# EAGLE design Camera (EAGLE 9.4.0)
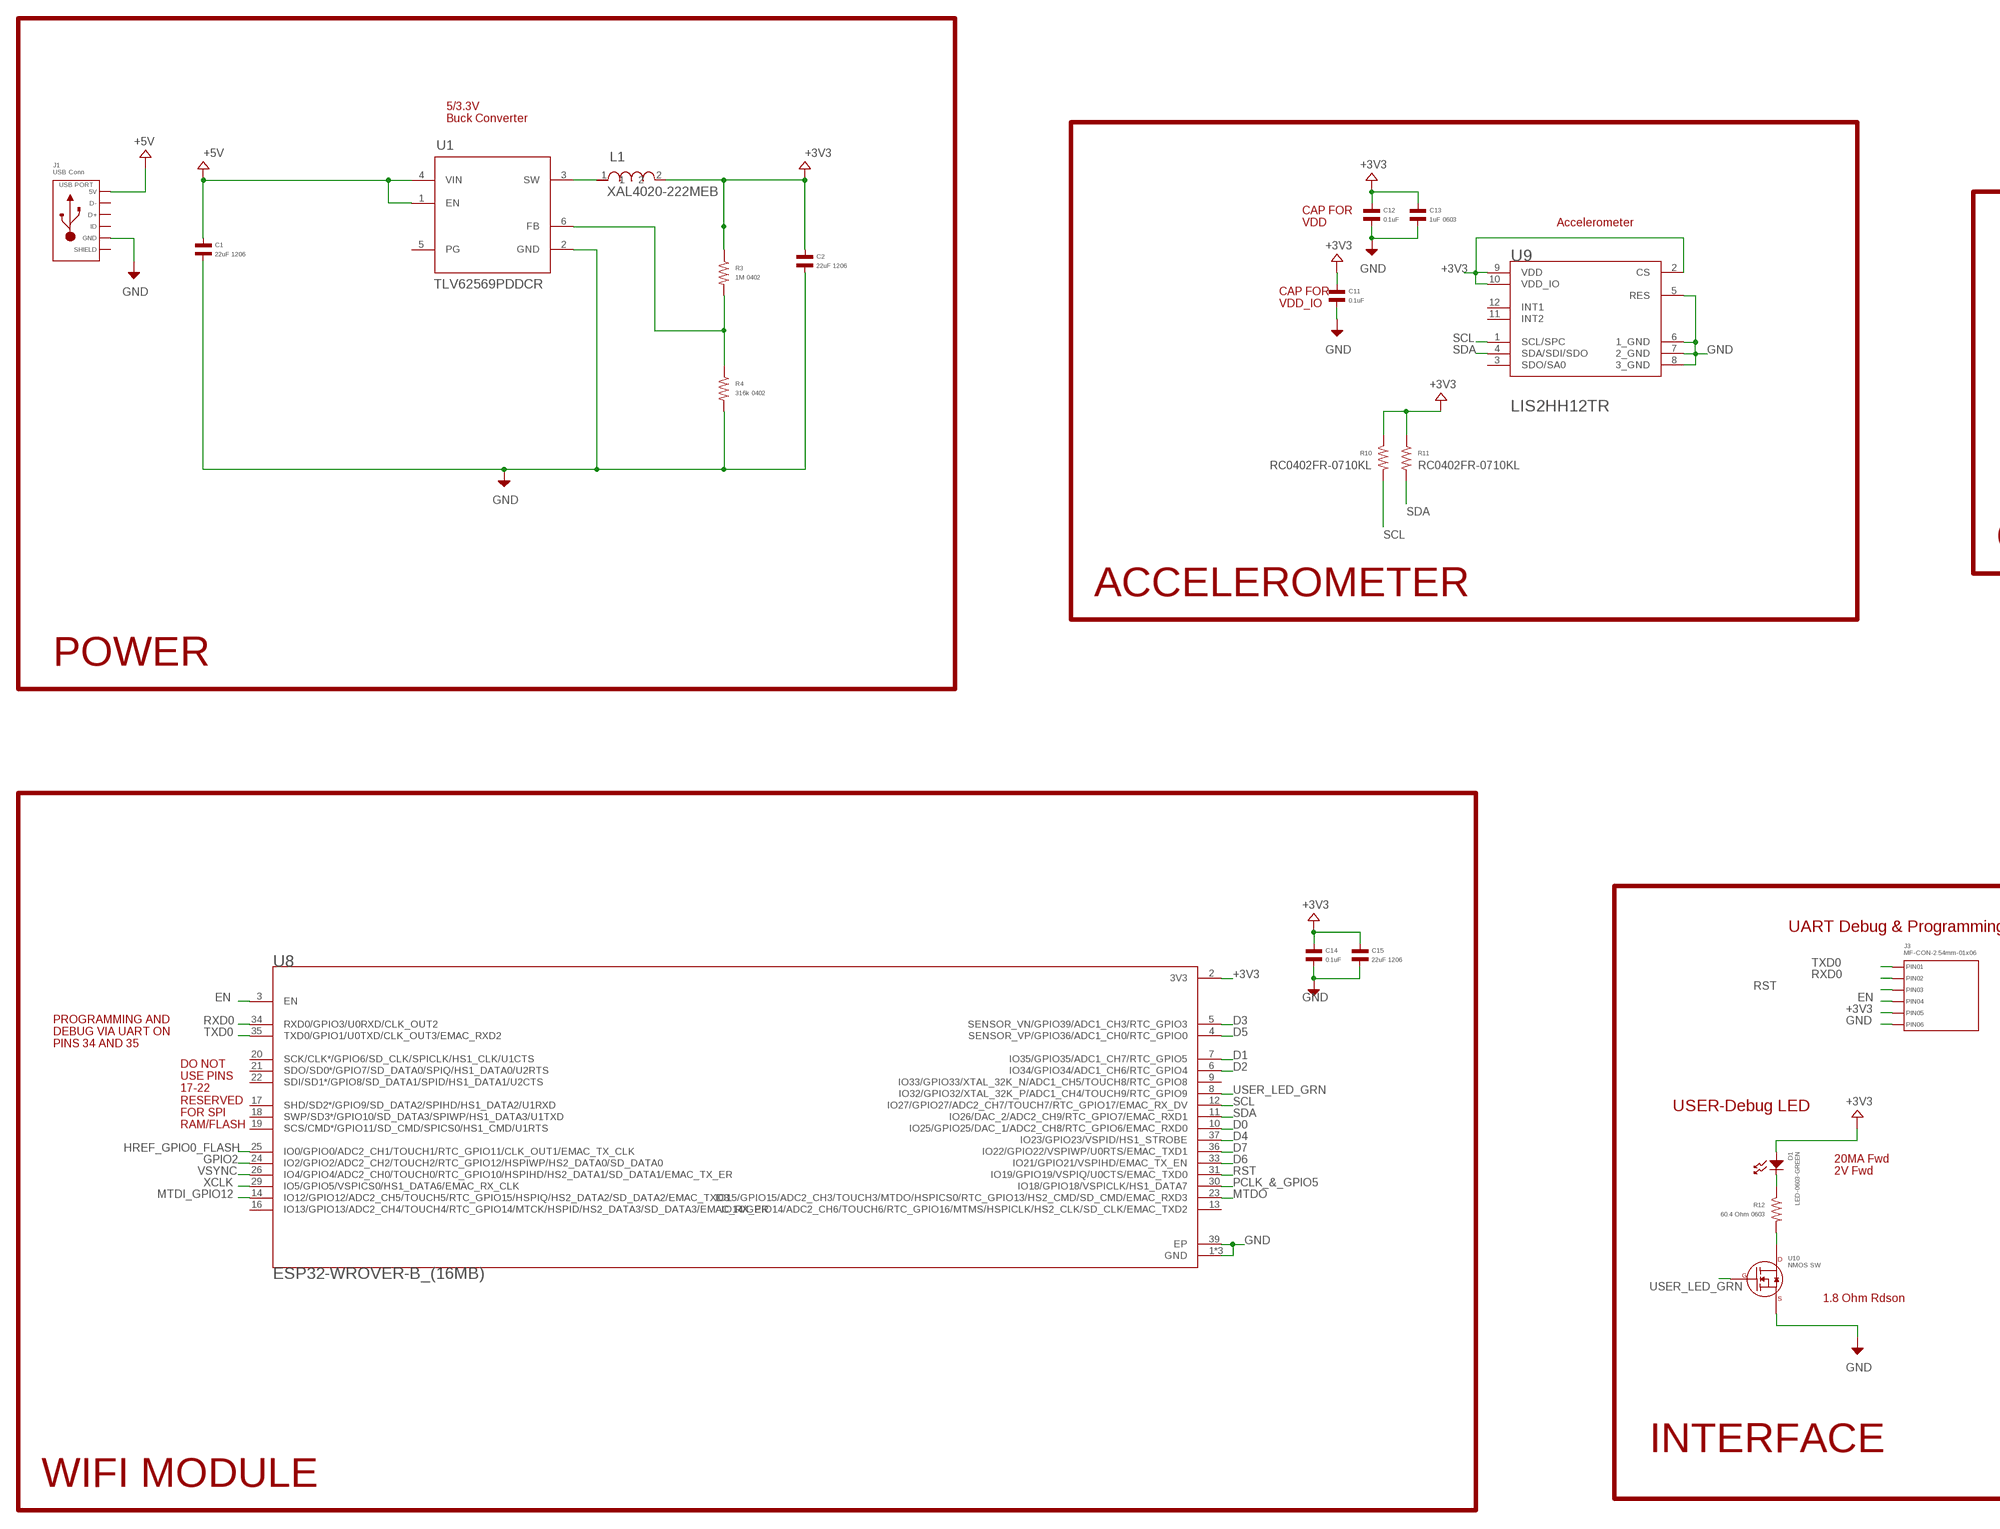
[diagram p0: schematic, sheet 1, part 1 of 2]
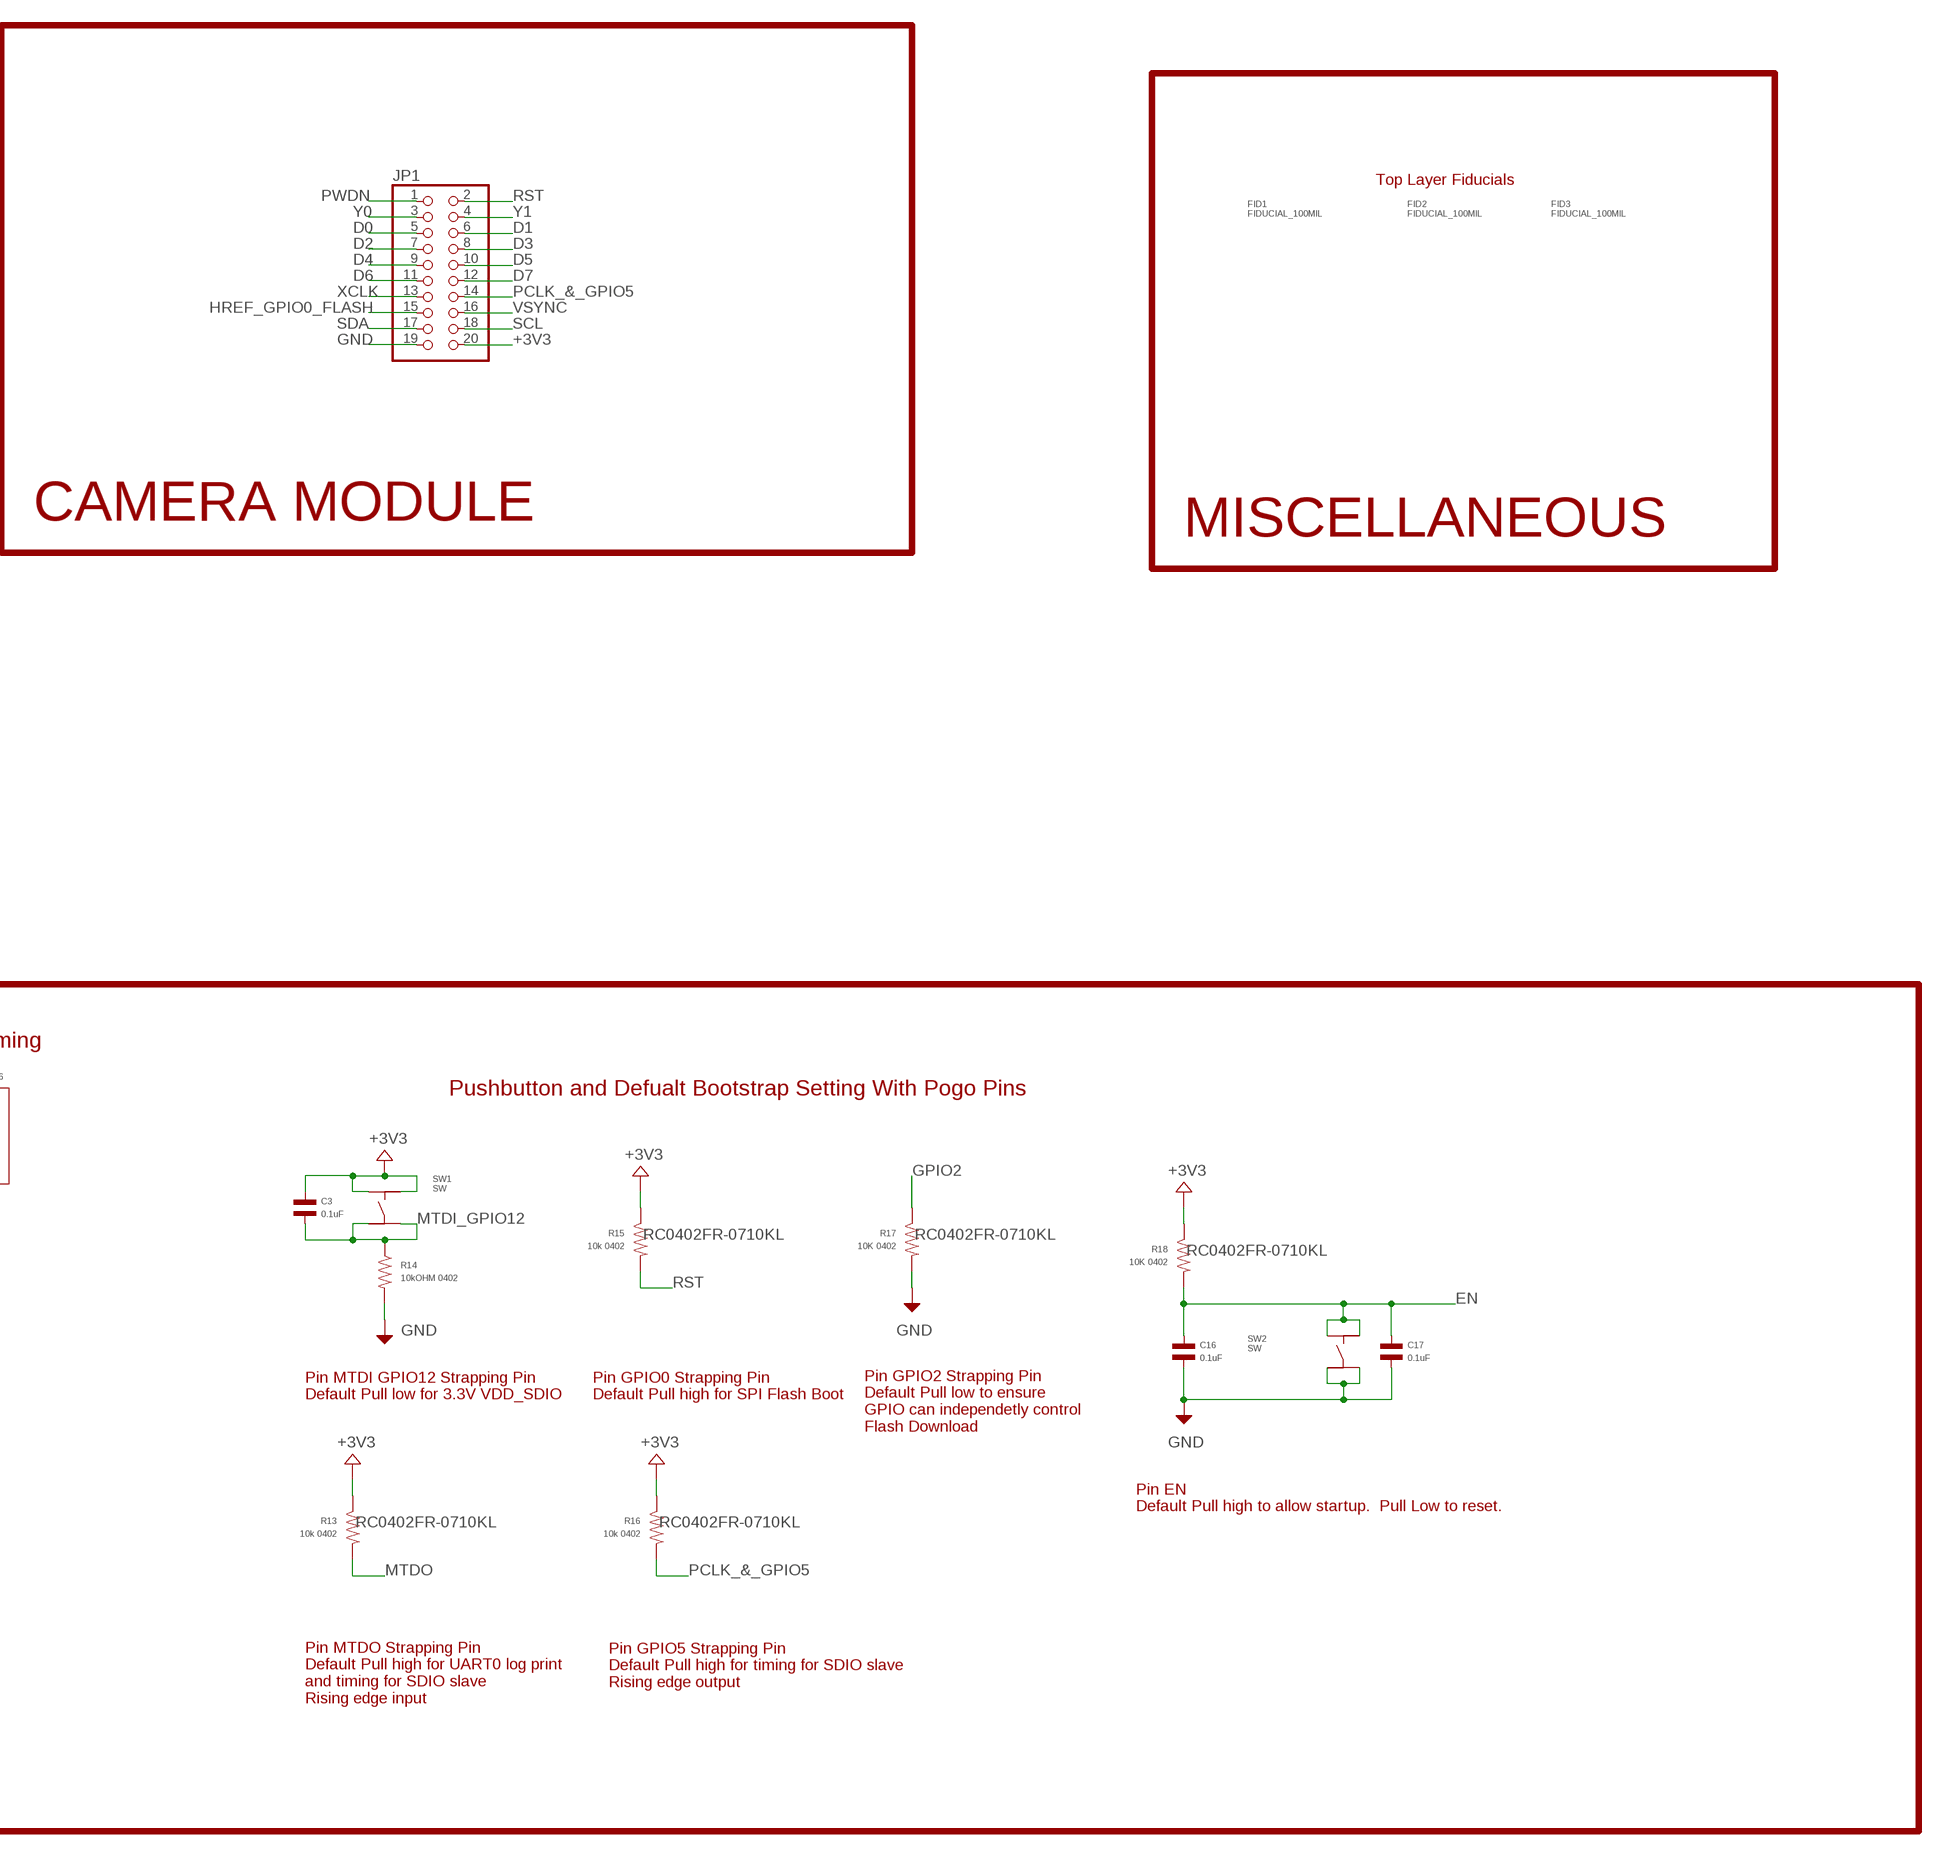
[diagram p1: schematic, sheet 1, part 2 of 2]

## Parts
C1  22uF 1206  CAPACITOR_NP_1206  [C1206]
C2  22uF 1206  CAPACITOR_NP_1206  [C1206]
C3  0.1uF  CAPACITOR_NP_0402  [C0402]
C11  0.1uF  CAPACITOR_NP_0402  [C0402]
C12  0.1uF  CAPACITOR_NP_0402  [C0402]
C13  1uF 0603  CAPACITOR_NP_0603  [C0603]
C14  0.1uF  CAPACITOR_NP_0402  [C0402]
C15  22uF 1206  CAPACITOR_NP_1206  [C1206]
C16  0.1uF  CAPACITOR_NP_0402  [C0402]
C17  0.1uF  CAPACITOR_NP_0402  [C0402]
D1  LED-0603-GREEN  LED_SINGLE-0603-GREEN  [LED0603]
FID1  FIDUCIAL_100MIL  [FIDUCIAL_100MIL]
FID2  FIDUCIAL_100MIL  [FIDUCIAL_100MIL]
FID3  FIDUCIAL_100MIL  [FIDUCIAL_100MIL]
J1  USB Conn  USB_MICRO_RIGHT  [MICROUSB-RIGHT]
J3  MF-CON-2.54mm-01x06  CON_01X06_PTH_2.54MM  [PTH_2.54MM_01X06]
JP1  PINHD-2X10  [2X10]
L1  XAL4020-222MEB  [XAL4020]
R3  1M 0402  RESISTOR_0402  [R0402]
R4  316k 0402  RESISTOR_0402  [R0402]
R10  RESISTOR_0402  [R0402]
R11  RESISTOR_0402  [R0402]
R12  60.4 Ohm 0603  RESISTOR_0603  [R0603]
R13  10k 0402  RESISTOR_0402  [R0402]
R14  10kOHM 0402  RESISTOR_0402  [R0402]
R15  10k 0402  RESISTOR_0402  [R0402]
R16  10k 0402  RESISTOR_0402  [R0402]
R17  10K 0402  RESISTOR_0402  [R0402]
R18  10K 0402  RESISTOR_0402  [R0402]
SW1  SW  TACT_6MM  [TACT6MM]
SW2  SW  TACT_6MM  [TACT6MM]
U1  TLV62569PDDCR  [DDC0006A]
U8  ESP32-WROVER-B_(16MB)  [XCVR_ESP32-WROVER-B_(16MB)]
U9  ST_MICROELECTRONICS_LIS2HH12TRST_MICROELECTRONICS_LIS2HH12TR_0_0  [ST_MICROELECTRONICS_LIS2HH12TR_0]
U10  NMOS SW  N-CHANNEL_FET_BSS138_SOT-23-3  [SOT-23-3]

## Nets
+3V3 [Power - 2A]: C2.P$1 C3.P$1 C11.P$1 C12.P$1 C13.P$1 C14.P$1 C15.P$1 D1.ANODE J3.P$5(PIN5) JP1.20 L1.2 R3.P$1 R10.P$1 R11.P$1 R13.P$1 R15.P$1 R16.P$1 R18.P$1 SW1.P$1 SW1.P$2 U8.2(3V3) U9.2(CS) U9.9(VDD) U9.10(VDD_IO)
+5V [Power - 2A]: C1.P$1 J1.1(5V) U1.1(EN) U1.4(VIN)
D0: JP1.5 U8.10(IO25/GPIO25/DAC_1/ADC2_CH8/RTC_GPIO6/EMAC_RXD0)
D1: JP1.6 U8.7(IO35/GPIO35/ADC1_CH7/RTC_GPIO5)
D2: JP1.7 U8.6(IO34/GPIO34/ADC1_CH6/RTC_GPIO4)
D3: JP1.8 U8.5(SENSOR_VN/GPIO39/ADC1_CH3/RTC_GPIO3)
D4: JP1.9 U8.37(IO23/GPIO23/VSPID/HS1_STROBE)
D5: JP1.10 U8.4(SENSOR_VP/GPIO36/ADC1_CH0/RTC_GPIO0)
D6: JP1.11 U8.33(IO21/GPIO21/VSPIHD/EMAC_TX_EN)
D7: JP1.12 U8.36(IO22/GPIO22/VSPIWP/U0RTS/EMAC_TXD1)
EN: C16.P$1 C17.P$1 J3.P$4(PIN4) R18.P$2 SW2.P$1 SW2.P$2 U8.3(EN)
GND [Power - 2A]: C1.P$2 C2.P$2 C11.P$2 C12.P$2 C13.P$2 C14.P$2 C15.P$2 C16.P$2 C17.P$2 J1.5(GND) J3.P$6(PIN6) JP1.19 R4.P$2 R14.P$2 R17.P$2 SW2.P$3 SW2.P$4 U1.2(GND) U8.1(GND) U8.15(GND) U8.38(GND) U8.39(EP) U9.5(RES) U9.6(1_GND) U9.7(2_GND) U9.8(3_GND) U10.P$2(SOURCE)
GPIO2: R17.P$1 U8.24(IO2/GPIO2/ADC2_CH2/TOUCH2/RTC_GPIO12/HSPIWP/HS2_DATA0/SD_DATA0)
HREF_GPIO0_FLASH: JP1.15 U8.25(IO0/GPIO0/ADC2_CH1/TOUCH1/RTC_GPIO11/CLK_OUT1/EMAC_TX_CLK)
MTDI_GPIO12: C3.P$2 R14.P$1 SW1.P$3 SW1.P$4 U8.14(IO12/GPIO12/ADC2_CH5/TOUCH5/RTC_GPIO15/HSPIQ/HS2_DATA2/SD_DATA2/EMAC_TXD3)
MTDO: R13.P$2 U8.23(IO15/GPIO15/ADC2_CH3/TOUCH3/MTDO/HSPICS0/RTC_GPIO13/HS2_CMD/SD_CMD/EMAC_RXD3)
N$12 [Power - 2A]: L1.1 U1.3(SW)
N$16: R3.P$2 R4.P$1 U1.6(FB)
N$20: D1.CATHODE R12.P$1
N$22: R12.P$2 U10.P$3(DRAIN)
PCLK_&_GPIO5: JP1.14 R16.P$2 U8.30(IO18/GPIO18/VSPICLK/HS1_DATA7)
PWDN: JP1.1
RST: J3.P$3(PIN3) JP1.2 R15.P$2 U8.31(IO19/GPIO19/VSPIQ/U0CTS/EMAC_TXD0)
RXD0: J3.P$2(PIN2) U8.34(RXD0/GPIO3/U0RXD/CLK_OUT2)
SCL: JP1.18 R10.P$2 U8.12(IO27/GPIO27/ADC2_CH7/TOUCH7/RTC_GPIO17/EMAC_RX_DV) U9.1(SCL/SPC)
SDA: JP1.17 R11.P$2 U8.11(IO26/DAC_2/ADC2_CH9/RTC_GPIO7/EMAC_RXD1) U9.4(SDA/SDI/SDO)
TXD0: J3.P$1(PIN1) U8.35(TXD0/GPIO1/U0TXD/CLK_OUT3/EMAC_RXD2)
USER_LED_GRN: U8.8(IO32/GPIO32/XTAL_32K_P/ADC1_CH4/TOUCH9/RTC_GPIO9) U10.P$1(GATE)
VSYNC: JP1.16 U8.26(IO4/GPIO4/ADC2_CH0/TOUCH0/RTC_GPIO10/HSPIHD/HS2_DATA1/SD_DATA1/EMAC_TX_ER)
XCLK: JP1.13 U8.29(IO5/GPIO5/VSPICS0/HS1_DATA6/EMAC_RX_CLK)
Y0: JP1.3
Y1: JP1.4
Unconnected: J1.2(D-) J1.3(D+) J1.4(ID) U1.5(PG) U8.9(IO33/GPIO33/XTAL_32K_N/ADC1_CH5/TOUCH8/RTC_GPIO8) U8.13(IO14/GPIO14/ADC2_CH6/TOUCH6/RTC_GPIO16/MTMS/HSPICLK/HS2_CLK/SD_CLK/EMAC_TXD2) U8.16(IO13/GPIO13/ADC2_CH4/TOUCH4/RTC_GPIO14/MTCK/HSPID/HS2_DATA3/SD_DATA3/EMAC_RX_ER) U8.17(SHD/SD2*/GPIO9/SD_DATA2/SPIHD/HS1_DATA2/U1RXD) U8.18(SWP/SD3*/GPIO10/SD_DATA3/SPIWP/HS1_DATA3/U1TXD) U8.19(SCS/CMD*/GPIO11/SD_CMD/SPICS0/HS1_CMD/U1RTS) U8.20(SCK/CLK*/GPIO6/SD_CLK/SPICLK/HS1_CLK/U1CTS) U8.21(SDO/SD0*/GPIO7/SD_DATA0/SPIQ/HS1_DATA0/U2RTS) U8.22(SDI/SD1*/GPIO8/SD_DATA1/SPID/HS1_DATA1/U2CTS) U9.3(SDO/SA0) U9.11(INT2) U9.12(INT1)

## Notes on the sheet
- 5/3.3V
  Buck Converter
- CAP FOR
  VDD
- Accelerometer
- CAP FOR
  VDD_IO
- Top Layer Fiducials
- CAMERA MODULE | MISCELLANEOUS
- ACCELEROMETER
- POWER
- UART Debug & Programming
- Pushbutton and Defualt Bootstrap Setting With Pogo Pins
- PROGRAMMING AND 
  DEBUG VIA UART ON 
  PINS 34 AND 35
- DO NOT 
  USE PINS 
  17-22
  RESERVED 
  FOR SPI 
  RAM/FLASH
- USER-Debug LED
- 20MA Fwd
  2V Fwd
- Pin MTDI GPIO12 Strapping Pin
  Default Pull low for 3.3V VDD_SDIO
- Pin GPIO0 Strapping Pin
  Default Pull high for SPI Flash Boot
- Pin GPIO2 Strapping Pin
  Default Pull low to ensure
  GPIO can independetly control
  Flash Download
- Pin EN
  Default Pull high to allow startup.  Pull Low to reset.
- 1.8 Ohm Rdson
- Pin GPIO5 Strapping Pin
  Default Pull high for timing for SDIO slave
  Rising edge output
- Pin MTDO Strapping Pin
  Default Pull high for UART0 log print
  and timing for SDIO slave 
  Rising edge input
- INTERFACE
- WIFI MODULE

## Power pins joined to a net without a drawn wire
SLD: J1.S1(SLD) J1.S2(SLD) J1.S3(SLD) J1.S4(SLD) J1.S5(SLD) J1.S6(SLD)

## Library data of the parts
C1 = MF_Passives:CAPACITOR_NP: Library: MF_Passives Description: Device for Non-Polarized Capacitors. Manufacture part number (MPN) can be added via Attributes. Check https://factory.macrofab.com/parts for the house parts list.; HOUSEPART: NO; MPN: CL31A226KPHNNNE; POPULATE: 1
C2 C15 = MF_Passives:CAPACITOR_NP: Library: MF_Passives Description: Device for Non-Polarized Capacitors. Manufacture part number (MPN) can be added via Attributes. Check https://factory.macrofab.com/parts for the house parts list.; HOUSEPART: YES; MPN: CL31A226KPHNNNE; POPULATE: 1
C3 C12 C14 C16 C17 = MF_Passives:CAPACITOR_NP: Library: MF_Passives Description: Device for Non-Polarized Capacitors. Manufacture part number (MPN) can be added via Attributes. Check https://factory.macrofab.com/parts for the house parts list.; HOUSEPART: NO; MPN: CL05B104KO5NNNC; POPULATE: 1
C11 = MF_Passives:CAPACITOR_NP: Library: MF_Passives Description: Device for Non-Polarized Capacitors. Manufacture part number (MPN) can be added via Attributes. Check https://factory.macrofab.com/parts for the house parts list.; HOUSEPART: No; MPN: CL05B104KO5NNNC; POPULATE: 1
C13 = MF_Passives:CAPACITOR_NP: Library: MF_Passives Description: Device for Non-Polarized Capacitors. Manufacture part number (MPN) can be added via Attributes. Check https://factory.macrofab.com/parts for the house parts list.; HOUSEPART: NO; MPN: CL05A105KO5NNNC; POPULATE: 1
D1 = MF_LEDs:LED_SINGLE: Library: MF_LEDs Description: Device for Single LED Packages. Manufacture part number (MFG#) can be added via Attributes.; HOUSEPART: NO; MPN: LTST-C190KGKT; POPULATE: 1; VALUE: MF-LED-0603-GREEN
FID1-FID3 = MF_Aesthetics:FIDUCIAL: Library: MF_Aesthetics Description: Fiducial marking for PCB alignment inside PNP and other machines.; HOUSEPART: NO; POPULATE: 0
J1 = MF_Connectors:USB: Library: MF_Connectors Description: 5 Pin USB Connectors. SLD is the shield connection. Usually tied to ground through a small ferrite bead.; HOUSEPART: NO; MPN: 10118193-0001LF; POPULATE: 1; VALUE: MF-CON-MICROUSB-RIGHT
J3 = MF_Connectors:CON_01X06: Library: MF_Connectors Description: Header Connector with 6 Positions and 01 Rows. Use the LABEL Attribute to label the pin on the schematic and PCB. You can remove the attributes on the PCB by using the SMASH function on the part and then deleting the text.; HOUSEPART: YES; MPN: MF-CON-2.54mm-01x06; POPULATE: 1; URL: https://factory.macrofab.com/part/MF-CON-2.54mm-01x06
JP1 = pinhead:PINHD-2X10: PIN HEADER
L1 = TIWB_TLV62569PDDC:XAL4020-222MEB; DATASHEETURL: httpwww.coilcraft.compdfsxal4000.pdf; DCR: 0.0352; IDC: 5.5; L: 2.2E6; MANUFACTURER_NAME: Coilcraft; MANUFACTURER_PART_NUMBER: XAL4020222MEB; VENDOR: Coilcraft
R3 = MF_Passives:RESISTOR: Library: MF_Passives Description: Device for Resistors. Manufacture part number (MPN), Voltage, Tolerance, and Wattage Rating can be added via Attributes. Check https://factory.macrofab.com/parts for the house parts list.; MPN: RC0402FR-071ML; POPULATE: 1
R4 = MF_Passives:RESISTOR: Library: MF_Passives Description: Device for Resistors. Manufacture part number (MPN), Voltage, Tolerance, and Wattage Rating can be added via Attributes. Check https://factory.macrofab.com/parts for the house parts list.; MPN: RC0402FR-07316KL; POPULATE: 1; TOLERANCE: 1%
R10 R11 R13-R18 = MF_Passives:RESISTOR: Library: MF_Passives Description: Device for Resistors. Manufacture part number (MPN), Voltage, Tolerance, and Wattage Rating can be added via Attributes. Check https://factory.macrofab.com/parts for the house parts list.; HOUSEPART: NO; MPN: RC0402FR-0710KL; POPULATE: 1
R12 = MF_Passives:RESISTOR: Library: MF_Passives Description: Device for Resistors. Manufacture part number (MPN), Voltage, Tolerance, and Wattage Rating can be added via Attributes. Check https://factory.macrofab.com/parts for the house parts list.; MPN: RC0603FR-0760R4L; POPULATE: 1
SW1 SW2 = MF_Switches:TACT: Library: MF_Switches Description: Device for Tact Switches. Manufacture part number (MFG#) can be added via Attributes.; HOUSEPART: NO; MPN: PTS645SM43SMTR92 LFS; POPULATE: 1; URL: https://factory.macrofab.com/part/MF-SW-TACT-6MM; VALUE: MF-SW-TACT-6MM
U1 = TIWB_TLV62569PDDC:TLV62569PDDCR; MANUFACTURER: Texas Instruments; MANUFACTURER_NAME: Texas Instruments; MPN: TLV62569PDDCR; PARTNUMBER: TLV62569PDDC; POPULATE: 1; REFDES: RefDes; TYPE: TYPE
U8 = ESP32-WROVER-B__16MB_:ESP32-WROVER-B_(16MB): WiFi SMD Module, ESP32-WROVER-B, 16MB Flash memory; AVAILABILITY: Unavailable; MF: Espressif Systems; MPN: ESP32-WROVER-B (16MB); PACKAGE: None; POPULATE: 1; PRICE: None
U9 = ST Microelectronics - LIS2HH12TR:ST_MICROELECTRONICS_LIS2HH12TR: ACCELEROMETER 2-8G I2C/SPI 12LGA; CENTROID_NOT_SPECIFIED: No; DATASHEET: http://www2.st.com/content/ccc/resource/technical/document/datasheet/c9/16/f2/79/ca/31/47/89/DM00096789.pdf/files/DM00096789.pdf/jcr:content/translations/en.DM00096789.pdf; DIGIKEY_DESCRIPTION: IC ACCELEROMETER 2-8G I2C/SPI 12LGA; DIGIKEY_PART_NUMBER: 497-15069-1-ND; LAND_PATTERN: http://www.st.com/content/ccc/resource/technical/document/technical_note/73/17/9c/16/dd/96/4a/01/CD00134799.pdf/files/CD00134799.pdf/jcr:content/translations/en.CD00134799.pdf; LEAD_FREE: yes; MF: ST Microelectronics; MOUSER_PART_NUMBER: 511-LIS2HH12TR; MPN: LIS2HH12TR; PACKAGE: VFLGA12; POPULATE: 1; PREFIX: U; ROHS: yes; TEMPERATURE_RANGE_HIGH: +85°C; TEMPERATURE_RANGE_LOW: -40°C
U10 = MF_Discrete_Semiconductor:N-CHANNEL_FET: Library: MF_Discrete_Semiconductor Description: Device for Single N-Channel Mosfet. Manufacture part number (MFG#) can be added via Attributes.; HOUSEPART: NO; MPN: BSS138; POPULATE: 1; VALUE: MF-DSC-SOT233-BSS138

## Net classes
0 Minimum: width 0.152 mm, drill 0.305 mm, clearance 0.152 mm
1 Power - 2A: width 0.813 mm, drill 0.305 mm, clearance 0.152 mm

## Board
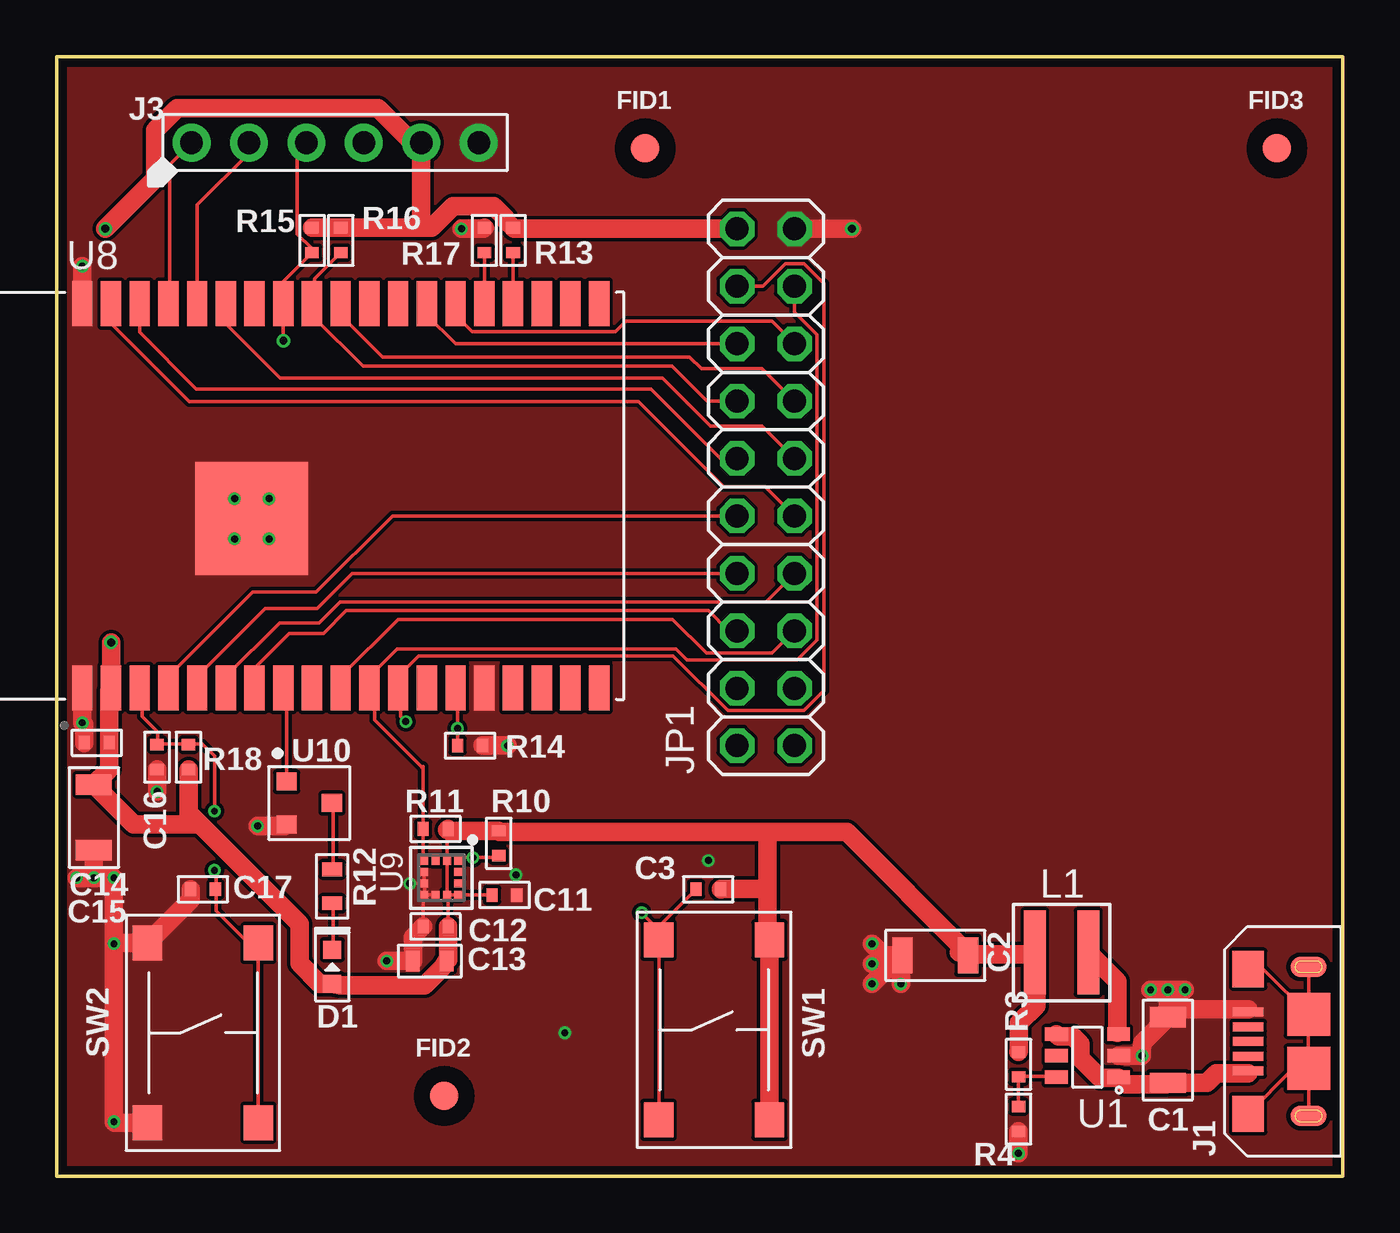
[diagram p2: board, top side]
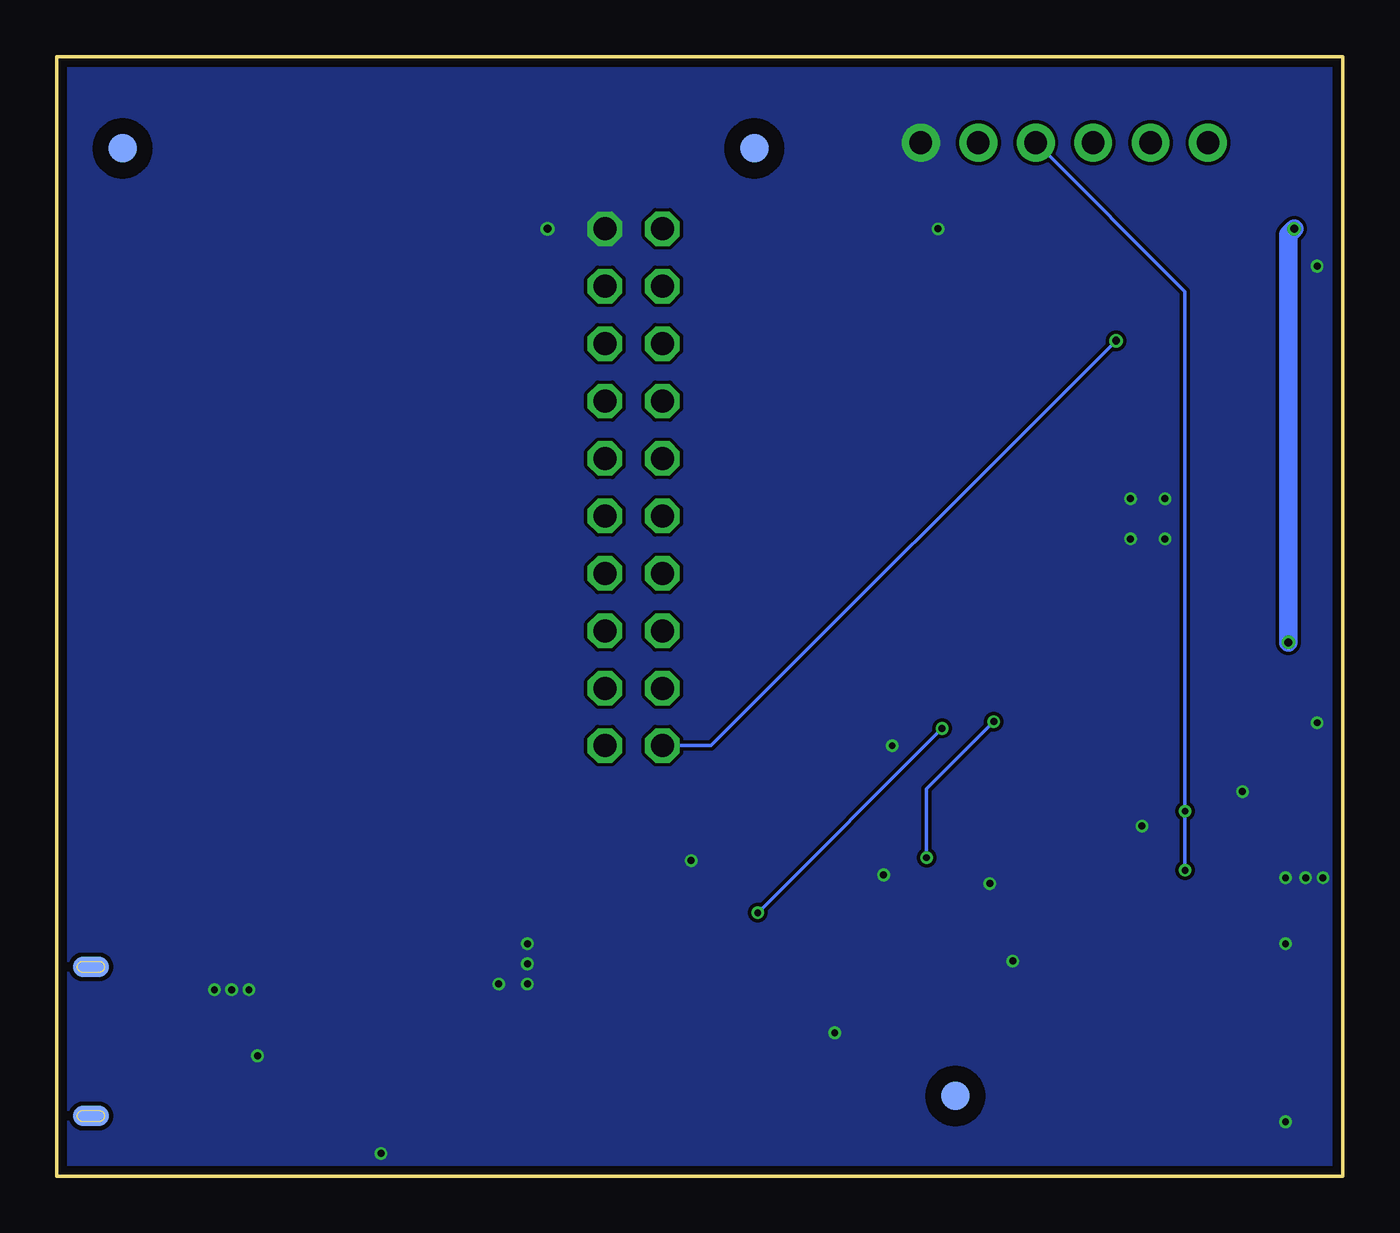
[diagram p3: board, bottom side, seen from below]

Size 56.9 x 49.53 mm. Coordinates in mm from the lower left corner, seen from the top.
Outline: 56.9,0 0,0 0,49.53 56.9,49.53 56.9,0
Copper layers (1*16): Top 0.035559375mm / dielectric 1.6mm / Bottom 0.035559375mm
Design rules "oshpark-2layer": minimum track width 6mil, minimum drill 10mil, track to track 6mil, track to pad 6mil, pad to pad 6mil, via to via 6mil, smd to smd 6mil, copper to edge 15mil, drill to drill 6mil, minimum pad ring 5mil, minimum via ring 5mil, stop-mask expansion 2.5mil, vias tented up to drill 0mil, thermal gap 10mil

### Footprints (pad centres in the part's own frame; a part is rotated, then mirrored left to right if it is on the bottom)
C1206 = smd 0.9 x 1.6: P$1 -1.45,0; P$2 1.45,0
C0402 = smd 0.5 x 0.6: P$1 -0.55,0; P$2 0.55,0
C0603 = smd 0.6 x 0.9: P$1 -0.75,0; P$2 0.75,0
LED0603 = smd 0.8 x 0.8: ANODE 0.75,0; CATHODE -0.75,0
FIDUCIAL_100MIL = smd 1.27 x 1.27: P$1 0,0 | smd 1.27 x 1.27 bottom: P$2 0,0
MICROUSB-RIGHT = smd 0.4 x 1.35: 1 -1.3,1.27; 2 -0.65,1.27; 3 0,1.27; 4 0.65,1.27; 5 1.3,1.27 | smd 0.9 x 1.6: S1 -3.3,-1.4; S2 3.3,-1.4 | smd 1.6 x 1.4: S3 -3.2,1.27; S4 3.2,1.27 | smd 1.9 x 1.9: S5 -1.2,-1.405; S6 1.2,-1.405 | smd 0.9 x 1.6 bottom: S7 -3.3,-1.4; S8 3.3,-1.4
PTH_2.54MM_01X06 = drill 1 pad 1.676: P$1 -6.35,0; P$2 -3.81,0; P$3 -1.27,0; P$4 1.27,0; P$5 3.81,0; P$6 6.35,0
2X10 = drill 1.016 octagon: 1 -11.43,-1.27; 2 -11.43,1.27; 3 -8.89,-1.27; 4 -8.89,1.27; 5 -6.35,-1.27; 6 -6.35,1.27; 7 -3.81,-1.27; 8 -3.81,1.27; 9 -1.27,-1.27; 10 -1.27,1.27; 11 1.27,-1.27; 12 1.27,1.27; 13 3.81,-1.27; 14 3.81,1.27; 15 6.35,-1.27; 16 6.35,1.27; 17 8.89,-1.27; 18 8.89,1.27; 19 11.43,-1.27; 20 11.43,1.27
XAL4020 = smd 0.965 x 3.708: 1 -1.181,0; 2 1.181,0
R0402 = smd 0.5 x 0.6: P$1 -0.55,0; P$2 0.55,0
R0603 = smd 0.6 x 0.9: P$1 -0.75,0; P$2 0.75,0
TACT6MM = smd 1.55 x 1.3: P$1 -3.975,2.45; P$2 3.975,2.45; P$3 -3.975,-2.45; P$4 3.975,-2.45
DDC0006A = smd 1 x 0.6: 1 -1.375,0.95; 2 -1.375,0; 3 -1.375,-0.95; 4 1.375,-0.95; 5 1.375,0; 6 1.375,0.95
XCVR_ESP32-WROVER-B_(16MB) = smd 2 x 0.9: 1 -8.5,8.26; 2 -8.5,6.99; 3 -8.5,5.72; 4 -8.5,4.45; 5 -8.5,3.18; 6 -8.5,1.91; 7 -8.5,0.64; 8 -8.5,-0.63; 9 -8.5,-1.9; 10 -8.5,-3.17; 11 -8.5,-4.44; 12 -8.5,-5.71; 13 -8.5,-6.98; 14 -8.5,-8.25; 15 -8.5,-9.52; 16 -8.5,-10.79; 17 -8.5,-12.06; 18 -8.5,-13.33; 19 -8.5,-14.6; 20 8.5,-14.6; 21 8.5,-13.33; 22 8.5,-12.06; 23 8.5,-10.79; 24 8.5,-9.52; 25 8.5,-8.25; 26 8.5,-6.98; 27 8.5,-5.71; 28 8.5,-4.44; 29 8.5,-3.17; 30 8.5,-1.9; 31 8.5,-0.63; 32 8.5,0.64; 33 8.5,1.91; 34 8.5,3.18; 35 8.5,4.45; 36 8.5,5.72; 37 8.5,6.99; 38 8.5,8.26 | smd 5 x 5: 39 -1,0.76
ST_MICROELECTRONICS_LIS2HH12TR_0 = smd 0.375 x 0.35: 1 -0.762,0.75; 2 -0.762,0.25; 3 -0.762,-0.25; 4 -0.762,-0.75; 7 0.762,-0.75; 8 0.762,-0.25; 9 0.762,0.25; 10 0.762,0.75 | smd 0.35 x 0.375: 5 -0.25,-0.762; 6 0.25,-0.762; 11 0.25,0.762; 12 -0.25,0.762
SOT-23-3 = smd 0.9 x 0.8: P$1 -1,0.95; P$2 -1,-0.95; P$3 1,0

### Placement (x,y rotation side)
C1  49.15,5.59 90 top
C2  38.86,9.78 180 top
C3  28.83,12.7 180 top
C11  19.81,12.45 0 top
C12  16.76,11.05 180 top
C13  16.51,9.53 180 top
C14  1.78,19.18 180 top
C15  1.65,15.87 270 top
C16  4.45,18.54 270 top
C17  6.48,12.7 180 top
D1  12.19,9.27 270 top
FID1  26.04,45.47 0 top
FID2  17.14,3.56 0 top
FID3  53.98,45.47 0 top
J1  53.98,5.97 90 top
J3  12.32,45.72 0 top
JP1  31.37,30.48 90 top
L1  44.45,9.91 180 top
R3  42.55,4.95 270 top
R4  42.55,2.54 270 top
R10  19.56,14.73 270 top
R11  16.76,15.37 180 top
R12  12.19,12.83 90 top
R13  20.19,41.4 270 top
R14  18.29,19.05 0 top
R15  11.3,41.4 270 top
R16  12.57,41.4 270 top
R17  18.92,41.4 90 top
R18  5.84,18.54 90 top
SW1  29.08,6.48 270 top
SW2  6.48,6.35 270 top
U1  45.59,5.33 180 top
U8  9.4,30.1 90 top
U9  17.02,13.21 270 top
U10  11.18,16.51 0 top

### Tracks (layer width: path | path; a pad name or v marks a point on that pad's centre or on a via)
+3V3  (via drill 0.35)
  Top 0.152: 17.27,15.32 U9.2 U9.9 | C12.P$1 17.31,12.4 U9.9 | U9.9 U9.10 18.41,12.45 C11.P$1
  Top 0.813: 1.8,17.3 1.65,17.3 C15.P$1 | 2.41,21.57 U8.2 | R3.P$1 42.57,5.56 42.57,6.78 43.33,7.54 43.33,8.08 43.26,8.15 43.26,9.91 L1.2 42.88,9.83 40.36,9.83 | 40.36,9.83 C2.P$1 39.9,9.91 | 31.44,12.72 31.44,10.59 31.52,10.52 SW1.P$1 SW1.P$2 | 31.44,12.72 31.44,15.24 | R15.P$1 R16.P$1 16.13,41.95 | 16.13,41.95 16.58,41.95 17.55,42.92 19.32,42.92 19.89,42.35 19.89,42.26 R13.P$1 20.23,41.91 JP1.20 | 16.13,41.95 J3.P$5 15.74,45.72 14.22,47.24 5.34,47.24 4.37,46.27 4.37,44.12 v2.16,41.91 | v2.41,23.62 2.41,21.57 | 6.35,15.57 10.74,11.18 10.74,9.42 11.65,8.52 D1.ANODE 12.55,8.46 16.28,8.46 17.04,9.22 C13.P$1 17.31,9.58 C12.P$1 | 6.35,15.57 5.84,16.08 R18.P$1 | C15.P$1 3.41,15.57 6.35,15.57 | 31.44,15.24 19.6,15.24 R10.P$1 17.4,15.28 R11.P$1 17.27,15.32 | C15.P$1 2.33,18 C14.P$1 2.33,21.48 2.41,21.57 | 40.36,9.83 34.95,15.24 31.44,15.24 | 31.44,12.72 29.39,12.72 C3.P$1
  Bottom 0.813: v2.16,41.91 2.41,41.66 v2.41,23.62
+5V
  Top 0.152: J1.1 52.7,4.56
  Top 0.61: 46.99,4.34 U1.1
  Top 0.813: U1.4 44.31,6.19 44.95,6.19 45.28,5.87 45.28,5.22 46.13,4.37 U1.1 | U1.1 47.27,4.06 49.08,4.06 C1.P$1 50.87,4.14 51.3,4.56 52.7,4.56 | 46.99,4.34 U1.1
D0
  Top 0.152: JP1.5 31.65,23.14 28.74,23.14 27.24,24.64 15.1,24.64 12.57,22.1 U8.10
D1
  Top 0.152: 30.07,24.08 JP1.6 29.72,24.13 28.83,25.02 12.82,25.02 11.81,24.01 10.28,24.01 8.76,22.49 U8.7
D2
  Top 0.152: JP1.7 31.37,25.4 12.54,25.4 11.62,24.48 9.86,24.48 7.49,22.1 U8.6
D3
  Top 0.152: JP1.8 13.08,26.67 11.52,25.11 9.22,25.11 6.22,22.1 U8.5
D4
  Top 0.152: JP1.9 31.34,30.5 29.5,30.5 25.75,34.26 5.86,34.26 2.41,37.71 U8.37
D5
  Top 0.152: JP1.10 14.86,29.21 11.48,25.84 8.68,25.84 4.95,22.1 U8.4
D6
  Top 0.152: JP1.11 31.21,33.18 28.92,33.18 26.8,35.3 9.9,35.3 7.49,37.71 U8.33
D7
  Top 0.152: JP1.12 29.36,31.75 26.28,34.83 6.18,34.83 3.68,37.33 U8.36
  Bottom 0.152: 30.07,31.7 JP1.12
EN  (via drill 0.3)
  Top 0.152: 5.84,19.13 4.47,19.13 C16.P$1 4.47,19.2 4.47,19.66 3.79,20.35 3.79,21.49 3.71,21.57 U8.3 | 5.84,19.13 6.45,19.13 6.98,18.59 v6.98,16.15 | v6.98,13.54 7.06,13.46 7.06,12.72 C17.P$1 7.06,12.65 7.06,11.73 8.43,10.36 8.89,10.36 SW2.P$1 SW2.P$2 | 5.84,19.13 R18.P$2
  Bottom 0.152: v6.98,13.54 v6.98,16.15 6.98,39.14 13.54,45.7 13.54,45.72 J3.P$4
GND  (via drill 0.3, 0.35)
  Top 0.152: C12.P$2 16.21,12.39 U9.7 | v15.62,12.95 U9.6 | U9.5 U9.6 | U9.7 16.27,12.95 U9.6 | U9.8 U9.7
  Top 0.813: v17.91,41.91 18.88,41.91 R17.P$2 | v19.94,19.05 R14.P$2 | v1.14,40.26 v1.14,40.25 U8.38 | v4.45,17.02 C16.P$2 | C14.P$2 1.23,19.98 v1.14,20.07 U8.1 | C15.P$2 v1.65,13.21 | v0.89,13.21 v1.65,13.21 | v1.65,13.21 v2.54,13.21 v2.54,10.29 | v2.54,10.29 2.58,10.32 SW2.P$3 5.93,12.22 C17.P$2 | SW2.P$4 2.58,2.37 v2.54,2.41 v2.54,10.29 | v14.61,9.53 C13.P$2 15.76,10.59 C12.P$2 | C1.P$2 v49.15,8.25 | v49.15,8.25 v49.91,8.25 | v49.15,8.25 v48.39,8.25 | C1.P$2 49.49,7.38 52.7,7.38 | C1.P$2 48.03,5.92 48.03,5.75 48.01,5.73 v48.01,5.33 U1.2 | R4.P$2 v42.55,1.02 | v37.34,8.51 37.34,9.71 | 37.34,9.71 C2.P$2 36.58,9.78 v36.07,10.29 | v36.07,9.4 37.03,9.4 37.34,9.71 | v36.07,8.51 37.26,9.71 37.34,9.71 | v8.89,15.49 10.11,15.49 U10.P$2 | JP1.19 v35.18,41.91
  other vias: 7.87,29.97 7.87,28.19 9.4,28.19 9.4,29.97 28.83,13.97 22.48,6.35 20.32,13.33
  pour Bottom (no thermals): 0,49.53 56.9,49.53 56.9,0 0,0
  pour Top (no thermals): 0,49.53 56.9,49.53 56.9,0 0,0
GPIO2
  Top 0.152: U8.24 R17.P$1
HREF_GPIO0_FLASH
  Top 0.152: JP1.15 31.65,37.82 25.18,37.82 24.73,37.37 18.37,37.37 17.65,38.1 U8.25
MTDI_GPIO12  (via drill 0.3)
  Top 0.152: R14.P$1 v17.73,19.81 17.73,21.49 17.65,21.57 U8.14 | SW1.P$4 26.64,2.52 26.64,10.44 SW1.P$3 | 26.57,10.97 v25.88,11.66 | 26.57,10.97 26.57,10.52 SW1.P$3 | 26.57,10.97 28.25,12.65 C3.P$2 | 26.57,10.97 SW1.P$3
  Bottom 0.152: v25.88,11.66 v17.73,19.81
MTDO
  Top 0.152: U8.23 R13.P$2
N$12
  Top 0.152: 46.91,6.34 U1.3
  Top 0.813: L1.1 46.91,8.62 46.91,6.34
N$16
  Top 0.152: U1.6 44.17,4.42 42.57,4.42 R3.P$2 R4.P$1
N$20
  Top 0.152: D1.CATHODE 12.24,10.06 12.24,12.04 R12.P$1
N$22
  Top 0.152: R12.P$2 12.24,13.64 12.24,16.46 U10.P$3
PCLK_&_GPIO5
  Top 0.152: 12.62,40.84 R16.P$2 11.42,39.7 11.42,38.47 | 11.33,38.56 U8.30 11.42,38.47 | 11.42,38.47 11.42,37.97 13.55,35.84 27.23,35.84 28.78,34.29 JP1.14
RST  (via drill 0.35)
  Top 0.152: 11.33,40.84 R15.P$2 | R15.P$2 11.25,40.92 11.25,41.07 10.64,41.68 10.64,45.34 11.02,45.72 J3.P$3 | 10.03,38.02 10.03,38.56 | 10.03,38.56 U8.31 v10.03,36.96 | 10.03,38.56 10.03,39.58 R15.P$2
  Bottom 0.152: v10.03,36.96 27.94,19.05 JP1.2
RXD0
  Top 0.152: J3.P$2 8.51,45.26 6.22,42.98 U8.34
SCL  (via drill 0.3)
  Top 0.152: v15.44,20.12 15.21,20.35 15.21,21.49 15.14,21.57 U8.12 | U9.1 17.89,14.1 v18.41,14.1 19.47,14.1 R10.P$2 | 15.14,21.64 U8.12 | U8.12 15.11,22.1 16.02,23.01 27.28,23.01 29.69,20.6 33.05,20.6 33.93,21.48 33.93,39.48 33.05,40.36 32.23,40.36 31.24,39.37 JP1.18
  Bottom 0.152: v18.41,14.1 18.41,17.14 v15.44,20.12 15.52,20.12
SDA
  Top 0.152: 16.17,18.1 14.07,20.19 14.07,21.34 13.84,21.57 U8.11 13.84,22.1 15.05,23.32 27.4,23.32 27.89,22.84 32.75,22.84 33.63,23.72 33.63,37.24 32.64,38.23 JP1.17 | 16.17,18.1 16.2,18.06 R11.P$2 16.21,14.02 U9.4 | 16.2,18.14 16.17,18.1 | 16.17,18.08 16.17,18.1
SLD
  Top 0.152: 55.37,4.72 J1.S5 J1.S6 | J1.S6 53.41,9.14 52.73,9.14 J1.S4 | J1.S2 J1.S6 | J1.S1 55.38,4.72 55.37,4.72 | 55.37,4.72 54.66,4.72 J1.S3
TXD0
  Top 0.152: U8.35 5,38.66 5,44.75 J3.P$1
USER_LED_GRN
  Top 0.152: U10.P$1 10.18,17.53 10.18,21.41 10.03,21.57 U8.8
VSYNC
  Top 0.152: JP1.16 17.64,36.83 16.38,38.1 U8.26
XCLK
  Top 0.152: JP1.13 31.21,35.72 28.53,35.72 28,36.25 14.42,36.25 12.57,38.1 U8.29